# Altium schematic sheet POWER_PCB_MAIN.SchDoc
size 400 x 200 mm; SheetNumber: 1; SheetTotal: 6
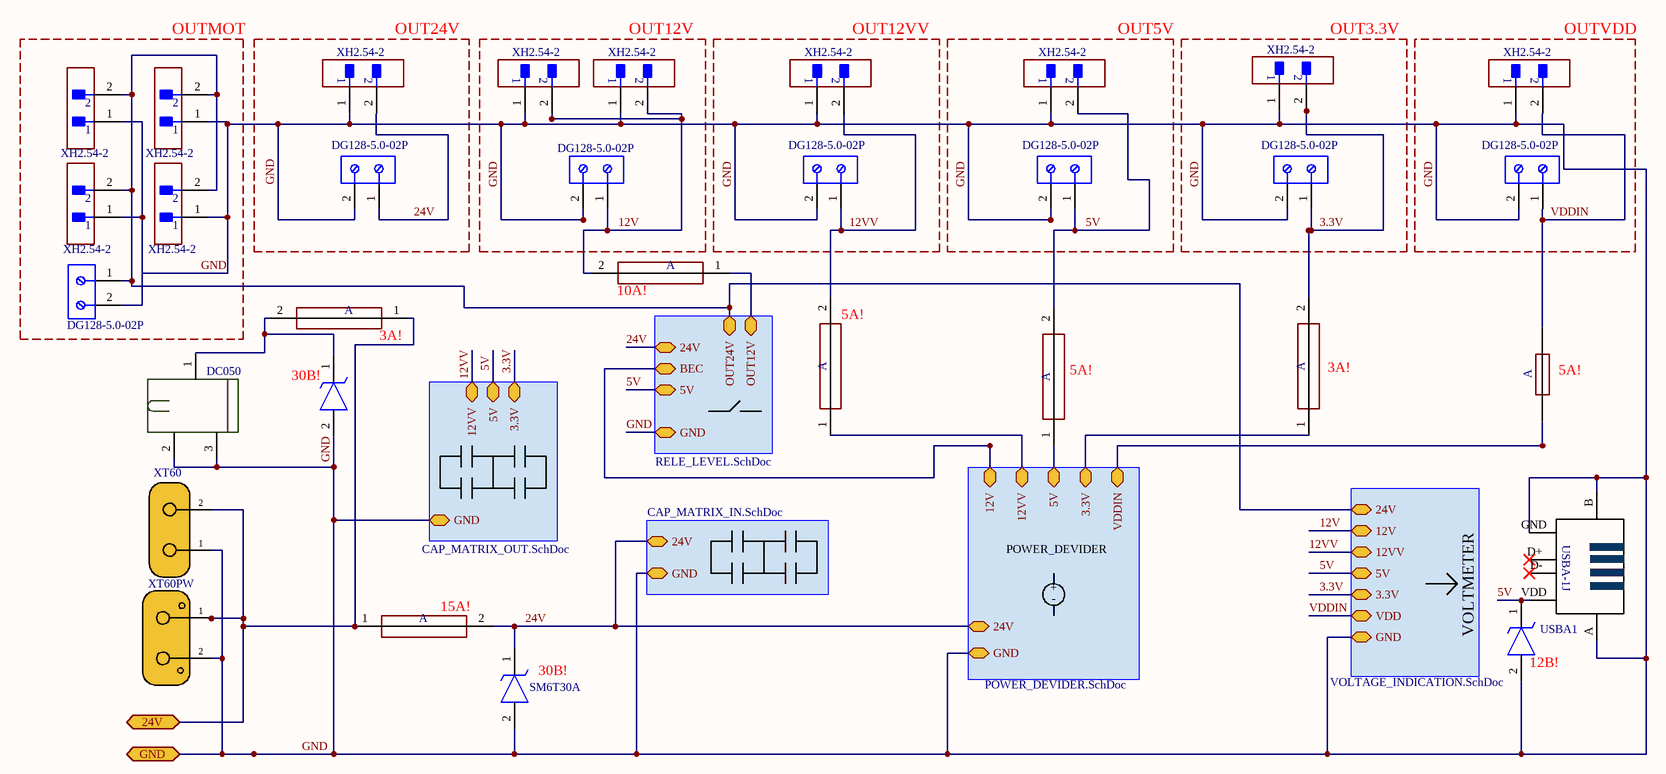
[diagram p0: POWER_PCB_MAIN.SchDoc]

## Parts
DCPLUG  DC050  [DC050]
DG3.3V2  DG128-5.0-02P  [DG128-5.0-02P]
DG5V2  DG128-5.0-02P  [DG128-5.0-02P]
DG12V2  DG128-5.0-02P  [DG128-5.0-02P]
DG12VV2  DG128-5.0-02P  [DG128-5.0-02P]
DG24V2  DG128-5.0-02P  [DG128-5.0-02P]
DGMOT  DG128-5.0-02P  [DG128-5.0-02P]
DGVDD2  DG128-5.0-02P  [DG128-5.0-02P]
ESDPLUG  SM6T30A  [SM6T-A]  (value not drawn)
ESDUSB  12В!  [SM6T-A]
ESDXT  SM6T30A  [SM6T-A]
FUSE3.3V  3A!  [Fuse]
FUSE5V  5A!  [Fuse]
FUSE12V  10A!  [Fuse]
FUSE12VV  5A!  [Fuse]
FUSEDC050  3A!  [Fuse]
FUSEIN  15A!  [Fuse]
SMDFUSEVDD  5A!  [SMD_Fuse]
USBA1  USBA1  [USBA-1JS]
XH3.3V  XH2.54-2  [XH2.54-2]
XH5V  XH2.54-2  [XH2.54-2]
XH12V1  XH2.54-2  [XH2.54-2]
XH12V2  XH2.54-2  [XH2.54-2]
XH12VV  XH2.54-2  [XH2.54-2]
XH24V  XH2.54-2  [XH2.54-2]
XHMOT1  XH2.54-2  [XH2.54-2]
XHMOT2  XH2.54-2  [XH2.54-2]
XHMOT3  XH2.54-2  [XH2.54-2]
XHMOT4  XH2.54-2  [XH2.54-2]
XHVDD2  XH2.54-2  [XH2.54-2]
XT60PW  (no value)  [XT60PW]
XT60W  XT60  [XT60]

## Blocks framed on the sheet
OUTMOT: DGMOT XHMOT1-XHMOT4
OUT24V: DG24V2 XH24V
OUT12V: DG12V2 XH12V1 XH12V2
OUT12VV: DG12VV2 XH12VV
OUT5V: DG5V2 XH5V
OUT3.3V: DG3.3V2 XH3.3V
OUTVDD: DGVDD2 XHVDD2

## Sub-sheets
POWER_DEVIDER = POWER_DEVIDER.SchDoc: GND (bidir), 24V (bidir), 12V (bidir), 5V (bidir), 12VV (bidir), 3.3V (bidir), VDDIN (bidir)
U_CAP_MATRIX = CAP_MATRIX_IN.SchDoc: 24V (bidir), GND (bidir)
U_CAP_MATRIX_OUT = CAP_MATRIX_OUT.SchDoc: GND (bidir), 12VV (bidir), 5V (bidir), 3.3V (bidir)
U_RELE_LEVEL = RELE_LEVEL.SchDoc: 24V (bidir), 5V (bidir), GND (bidir), BEC (bidir), OUT24V (bidir), OUT12V (bidir)
U_VOLTAGE_INDICATION = VOLTAGE_INDICATION.SchDoc: 24V (bidir), 12V (bidir), 12VV (bidir), 5V (bidir), 3.3V (bidir), VDD (bidir), GND (bidir)

## Ports
24V (bidir), GND (bidir)

## Nets
3.3V: DG3.3V2.1 FUSE3.3V.2 XH3.3V.2 ; sheet U_VOLTAGE_INDICATION/3.3V, sheet U_CAP_MATRIX_OUT/3.3V
5V: DG5V2.1 ESDUSB.1 FUSE5V.2 USBA1.VDD XH5V.2 ; sheet U_VOLTAGE_INDICATION/5V, sheet U_CAP_MATRIX_OUT/5V, sheet U_RELE_LEVEL/5V
12V: DG12V2.1 FUSE12V.2 XH12V1.2 XH12V2.2 ; sheet U_VOLTAGE_INDICATION/12V
12VV: DG12VV2.1 FUSE12VV.2 XH12VV.2 ; sheet U_VOLTAGE_INDICATION/12VV, sheet U_CAP_MATRIX_OUT/12VV
24V: DG24V2.1 ESDXT.1 FUSEIN.2 XH24V.2 ; sheet POWER_DEVIDER/24V, sheet U_CAP_MATRIX/24V, sheet U_RELE_LEVEL/24V
24V: FUSEDC050.1 FUSEIN.1 XT60PW.1 XT60W.2 ; port 24V  [a separate net that carries the same name]
GND: DCPLUG.2 DCPLUG.3 DG3.3V2.2 DG5V2.2 DG12V2.2 DG12VV2.2 DG24V2.2 DGMOT.2 DGVDD2.2 ESDPLUG.2 ESDUSB.2 ESDXT.2 USBA1.A USBA1.B(MH2) USBA1.GND XH3.3V.1 XH5V.1 XH12V1.1 XH12V2.1 XH12VV.1 XH24V.1 XHMOT1.1 XHMOT2.1 XHMOT3.1 XHMOT4.1 XHVDD2.1 XT60PW.2 XT60W.1 ; port GND, sheet POWER_DEVIDER/GND, sheet U_VOLTAGE_INDICATION/GND, sheet U_CAP_MATRIX/GND, sheet U_CAP_MATRIX_OUT/GND, sheet U_RELE_LEVEL/GND
VDDIN: DGVDD2.1 SMDFUSEVDD.2 XHVDD2.2 ; sheet U_VOLTAGE_INDICATION/VDD
NetDCPLUG_1: DCPLUG.1 ESDPLUG.1 FUSEDC050.2
NetDGMOT_1: DGMOT.1 XHMOT1.2 XHMOT2.2 XHMOT3.2 XHMOT4.2 ; sheet U_VOLTAGE_INDICATION/24V, sheet U_RELE_LEVEL/OUT24V
NetFUSE3.3V_1: FUSE3.3V.1 ; sheet POWER_DEVIDER/3.3V
NetFUSE5V_1: FUSE5V.1 ; sheet POWER_DEVIDER/5V
NetFUSE12V_1: FUSE12V.1 ; sheet U_RELE_LEVEL/OUT12V
NetFUSE12VV_1: FUSE12VV.1 ; sheet POWER_DEVIDER/12VV
NetSMDFUSEVDD_1: SMDFUSEVDD.1 ; sheet POWER_DEVIDER/VDDIN
(unnamed): sheet POWER_DEVIDER/12V, sheet U_RELE_LEVEL/BEC

Not connected (* = marked no-connect by the designer): USBA1 D+(3)* D-(2)*

## Notes on the sheet
- (near ESDPLUG) 30В!
- +
- -
- (near ESDXT) 30В!
- (near ESDUSB) VOLTMETER
- (in symbol Fuse) A
- (in symbol SMD_Fuse) A
- (in symbol USBA-1JS) USBA-1J

## Library data of the parts
DCPLUG = DC050: DC050-T
DG3.3V2 DG5V2 DG12V2 DG12VV2 DG24V2 DGMOT DGVDD2 = DG128-5.0-02P: DG128-5.0-02P-14
ESDPLUG ESDUSB ESDXT = SM6T-A: SM6T12A-SMD
FUSE3.3V FUSE5V FUSE12V FUSE12VV FUSEDC050 FUSEIN = Fuse: KLS5-242 & BLX-A & BF-013
SMDFUSEVDD = SMD_Fuse: 01550900M
USBA1 = USBA-1JS: DS1095-10
XH3.3V XH5V XH12V1 XH12V2 XH12VV XH24V XHMOT1-XHMOT4 XHVDD2 = XH2.54-2: JST XH2.54-2pin
XT60PW = XT60PW: XT60PW-F
XT60W = XT60: XT60U-F